# EAGLE design ecg (EAGLE 6.4)
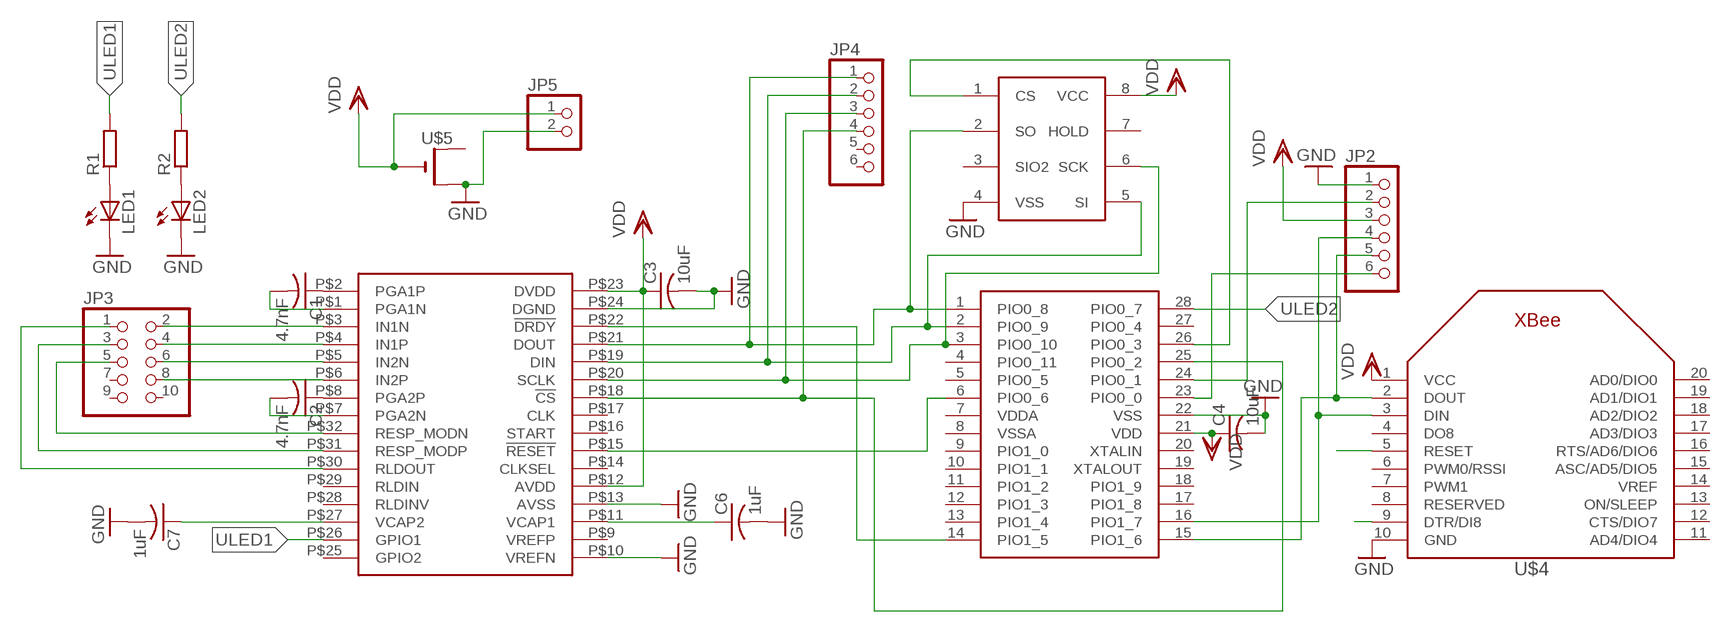
[diagram p0: schematic, sheet 1]

## Parts
C1  4.7nF  C-USC0805  [C0805]
C2  4.7nF  C-USC0805  [C0805]
C3  10uF  C-USC0805  [C0805]
C4  10uF  C-USC0805  [C0805]
C6  1uF  C-USC0805  [C0805]
C7  1uF  C-USC0805  [C0805]
JP2  PINHD-1X6  [1X06]
JP3  PINHD-2X5  [2X05]
JP4  PINHD-1X6  [1X06]
JP5  PINHD-1X2  [1X02]
LED1  LED3MM  [LED3MM]
LED2  LED3MM  [LED3MM]
R1  R-EU_R0805  [R0805]
R2  R-EU_R0805  [R0805]
U$1  ADS1929R  [TQFP32]
U$2  LPC1114FN28  [DIL28-6]
U$3  23A1024  [DIL08]
U$4  XBEE  [XBEE]
U$5  CR2032SMT  [CR2032-SMD]

## Nets
GND: C3.2 C4.2 C6.2 C7.2 JP2.1 JP5.2 LED1.K(C) LED2.K(C) U$1.P$10(VREFN) U$1.P$13(AVSS) U$1.P$24(DGND) U$2.22(VSS) U$3.4(VSS) U$4.10(GND) U$5.+$2(+1)
N$1: C1.1 U$1.P$2(PGA1P)
N$2: C1.2 U$1.P$1(PGA1N)
N$3: C2.1 U$1.P$8(PGA2P)
N$4: C2.2 U$1.P$7(PGA2N)
N$5: JP4.1 U$1.P$21(DOUT) U$2.1(PIO0_8) U$3.2(SO)
N$6: JP4.2 U$1.P$19(DIN) U$2.2(PIO0_9) U$3.5(SI)
N$7: JP4.3 U$1.P$20(SCLK) U$2.3(PIO0_10) U$3.6(SCK)
N$8: JP4.4 U$1.P$18(!CS!) U$2.25(PIO0_2)
N$9: U$1.P$22(!DRDY!) U$2.14(PIO1_5)
N$10: JP3.2 U$1.P$3(IN1N)
N$11: JP3.4 U$1.P$4(IN1P)
N$12: JP3.6 U$1.P$5(IN2N)
N$13: JP3.8 U$1.P$6(IN2P)
N$14: U$1.P$15(!RESET!) U$2.6(PIO0_6)
N$15: JP3.5 U$1.P$32(RESP_MODN)
N$16: JP3.3 U$1.P$31(RESP_MODP)
N$17: JP3.1 U$1.P$30(RLDOUT)
N$20: JP2.6 U$2.23(PIO0_0)
N$21: U$2.26(PIO0_3) U$3.1(CS)
N$22: JP2.5 U$2.15(PIO1_6) U$4.2(DOUT)
N$23: JP2.4 U$2.16(PIO1_7) U$4.3(DIN)
N$24: JP2.2 U$2.24(PIO0_1)
N$27: C6.1 U$1.P$11(VCAP1)
N$28: U$4.5(RESET)
N$29: LED1.A R1.1
N$30: LED2.A R2.1
N$31: U$4.9(DTR/DI8)
N$32: C7.1 U$1.P$27(VCAP2)
ULED1: R1.2 U$1.P$26(GPIO1)
ULED2: R2.2 U$2.28(PIO0_7)
VDD: C3.1 C4.1 JP2.3 JP5.1 U$1.P$12(AVDD) U$1.P$23(DVDD) U$2.21(VDD) U$3.8(VCC) U$4.1(VCC) U$5.-
Unconnected: JP3.7 JP3.9 JP3.10 JP4.5 JP4.6 U$1.P$9(VREFP) U$1.P$14(CLKSEL) U$1.P$16(START) U$1.P$17(CLK) U$1.P$25(GPIO2) U$1.P$28(RLDINV) U$1.P$29(RLDIN) U$2.4(PIO0_11) U$2.5(PIO0_5) U$2.7(VDDA) U$2.8(VSSA) U$2.9(PIO1_0) U$2.10(PIO1_1) U$2.11(PIO1_2) U$2.12(PIO1_3) U$2.13(PIO1_4) U$2.17(PIO1_8) U$2.18(PIO1_9) U$2.19(XTALOUT) U$2.20(XTALIN) U$2.27(PIO0_4) U$3.3(SIO2) U$3.7(HOLD) U$4.4(DO8) U$4.6(PWM0/RSSI) U$4.7(PWM1) U$4.8(RESERVED) U$4.11(AD4/DIO4) U$4.12(CTS/DIO7) U$4.13(ON/SLEEP) U$4.14(VREF) U$4.15(ASC/AD5/DIO5) U$4.16(RTS/AD6/DIO6) U$4.17(AD3/DIO3) U$4.18(AD2/DIO2) U$4.19(AD1/DIO1) U$4.20(AD0/DIO0) U$5.+$1(+)

## Library data of the parts
C1-C4 C6 C7 = adafruit:C-US: CAPACITOR, American symbol
JP2 JP4 = pinhead:PINHD-1X6: PIN HEADER
JP3 = pinhead:PINHD-2X5: PIN HEADER
JP5 = pinhead:PINHD-1X2: PIN HEADER
LED1 LED2 = adafruit:LED: LED OSRAM: - CHIPLED LG R971, LG N971, LY N971, LG Q971, LY Q971, LO R971, LY R971 LH N974, LH R974 LS Q976, LO Q976, LY Q976 LO Q996 - Hyper CHIPLED LW Q18S LB Q993, LB Q99A, LB R99A - SideLED LS A670, LO A670, LY A670, LG A670, LP A670 LB A673, LV A673, LT A673, LW A673 LH A674 LY A675 LS A676, LA A676, LO A676, LY A676, LW A676 LS A679, LY A679, LG A679 - Hyper Micro SIDELED® LS Y876, LA Y876, LO Y876, LY Y876 LT Y87S - SmartLED LW L88C, LW L88S LB L89C, LB L89S, LG L890 LS L89K, LO L89K, LY L89K LS L896, LA L896, LO L896, LY L896 - TOPLED LS T670, LO T670, LY T670, LG T670, LP T670 LSG T670, LSP T670, LSY T670, LOP T670, LYG T670 LG T671, LOG T671, LSG T671 LB T673, LV T673, LT T673, LW T673 LH T674 LS T676, LA T676, LO T676, LY T676, LB T676, LH T676, LSB T676, LW T676 LB T67C, LV T67C, LT T67C, LS T67K, LO T67K, LY T67K, LW E67C LS E67B, LA E67B, LO E67B, LY E67B, LB E67C, LV E67C, LT E67C LW T67C LS T679, LY T679, LG T679 LS T770, LO T770, LY T770, LG T770, LP T770 LB T773, LV T773, LT T773, LW T773 LH T774 LS E675, LA E675, LY E675, LS T675 LS T776, LA T776, LO T776, LY T776, LB T776 LHGB T686 LT T68C, LB T68C - Hyper Mini TOPLED® LB M676 - Mini TOPLED Santana® LG M470 LS M47K, LO M47K, LY M47K Source: http://www.osram.convergy.de/
R1 R2 = resistor:R-EU_: RESISTOR, European symbol
U$1 = ads1x9x:ADS1929R
U$2 = lpc1114fn28:LPC1114FN28
U$3 = 23a1024:23A1024
U$4 = adafruit:XBEE
U$5 = adafruit:CR2032

## Board
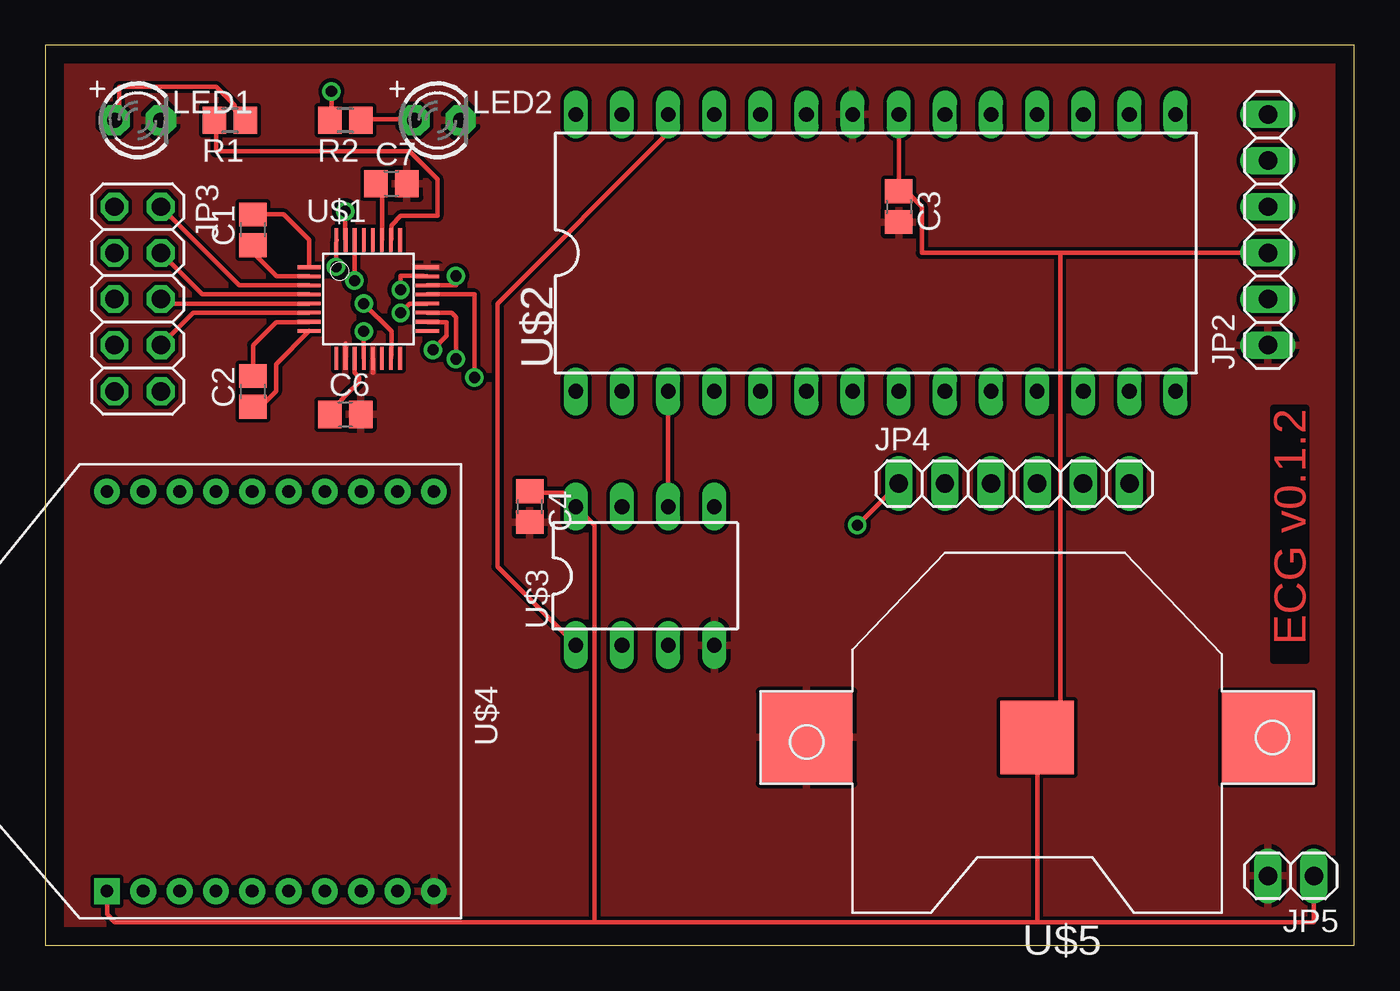
[diagram p1: board, top side]
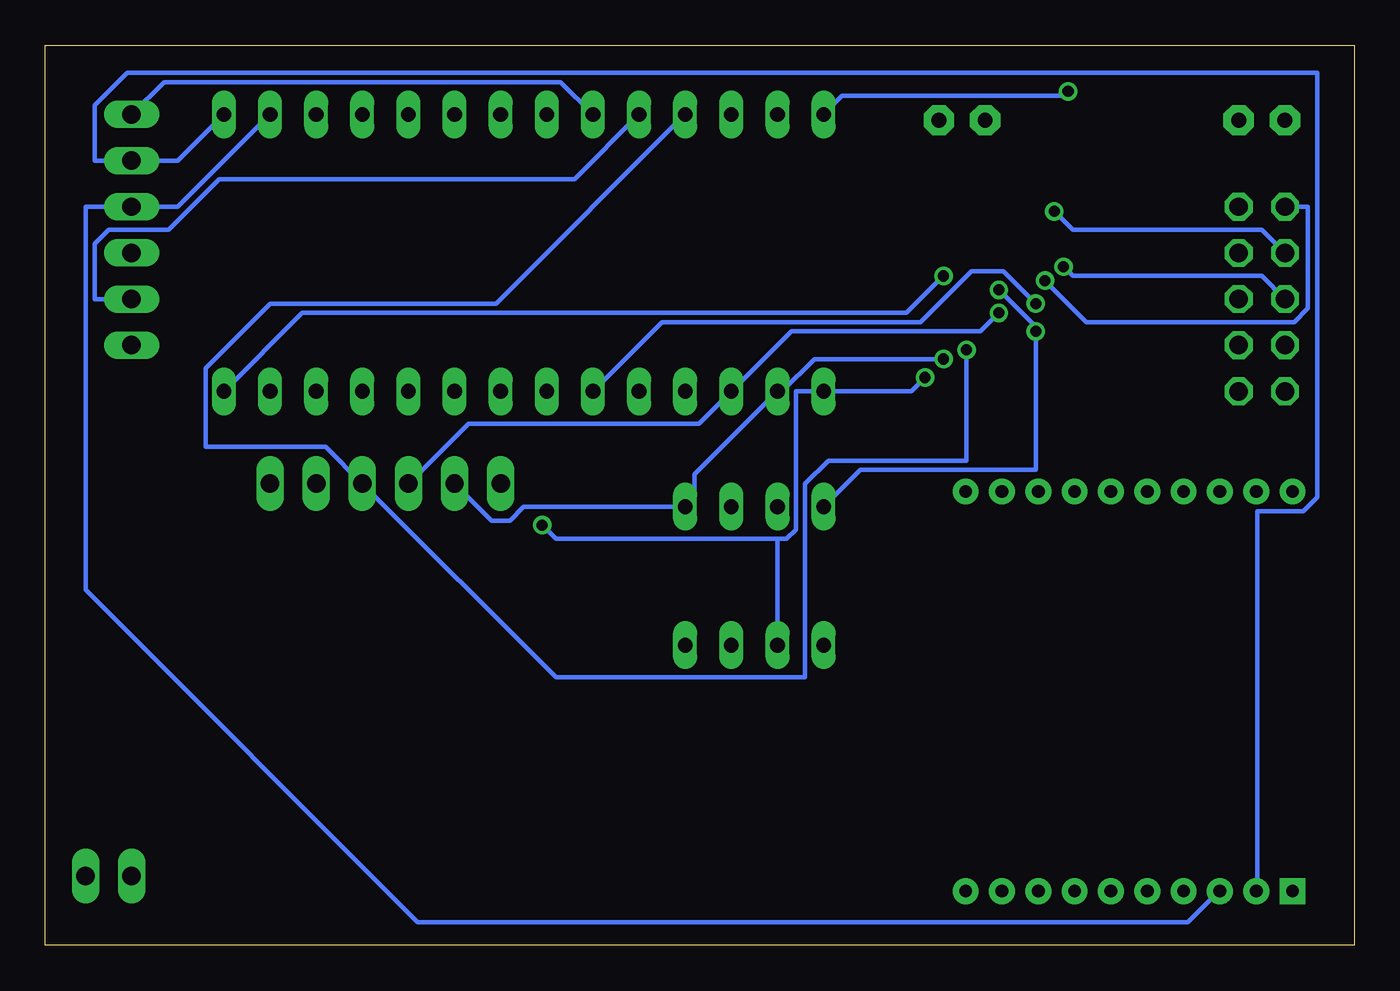
[diagram p2: board, bottom side, seen from below]

Size 72.06 x 49.52 mm. Coordinates in mm from the lower left corner, seen from the top.
Outline: 0,0 72.06,0 72.06,49.52 0,49.52 0,0
Copper layers (1*16): Top 0.035mm / dielectric 1.5mm / Bottom 0.035mm
Design rules "default": minimum track width 10mil, minimum drill 24mil, track to track 8mil, track to pad 8mil, pad to pad 8mil, via to via 8mil, smd to smd 8mil, copper to edge 40mil, drill to drill 8mil, minimum pad ring 10mil, minimum via ring 8mil, stop-mask expansion 4mil, vias tented up to drill 0mil, thermal gap 10mil

### Footprints (pad centres in the part's own frame; a part is rotated, then mirrored left to right if it is on the bottom)
C0805 = smd 1.3 x 1.5: 1 -0.85,0; 2 0.85,0
1X06 = drill 1.016 long: 1 -6.35,0; 2 -3.81,0; 3 -1.27,0; 4 1.27,0; 5 3.81,0; 6 6.35,0
2X05 = drill 1.016 octagon: 1 -5.08,-1.27; 2 -5.08,1.27; 3 -2.54,-1.27; 4 -2.54,1.27; 5 0,-1.27; 6 0,1.27; 7 2.54,-1.27; 8 2.54,1.27; 9 5.08,-1.27; 10 5.08,1.27
1X02 = drill 1.016 long: 1 -1.27,0; 2 1.27,0
LED3MM = drill 0.813 pad 1.676 octagon: A -1.27,0; K 1.27,0
R0805 = smd 1.3 x 1.5: 1 -0.85,0; 2 0.85,0
TQFP32 = smd 1.27 x 0.2: P$1 -3.25,1.75; P$2 -3.25,1.25; P$3 -3.25,0.75; P$4 -3.25,0.25; P$5 -3.25,-0.25; P$6 -3.25,-0.75; P$7 -3.25,-1.25; P$8 -3.25,-1.75; P$17 3.25,-1.75; P$18 3.25,-1.25; P$19 3.25,-0.75; P$20 3.25,-0.25; P$21 3.25,0.25; P$22 3.25,0.75; P$23 3.25,1.25; P$24 3.25,1.75 | smd 0.2 x 1.27: P$9 -1.75,-3.25; P$10 -1.25,-3.25; P$11 -0.75,-3.25; P$12 -0.25,-3.25; P$13 0.25,-3.25; P$14 0.75,-3.25; P$15 1.25,-3.25; P$16 1.75,-3.25; P$25 1.75,3.25; P$26 1.25,3.25; P$27 0.75,3.25; P$28 0.25,3.25; P$29 -0.25,3.25; P$30 -0.75,3.25; P$31 -1.25,3.25; P$32 -1.75,3.25
DIL28-6 = drill 0.813 long: 1 -16.51,-7.62; 2 -13.97,-7.62; 3 -11.43,-7.62; 4 -8.89,-7.62; 5 -6.35,-7.62; 6 -3.81,-7.62; 7 -1.27,-7.62; 8 1.27,-7.62; 9 3.81,-7.62; 10 6.35,-7.62; 11 8.89,-7.62; 12 11.43,-7.62; 13 13.97,-7.62; 14 16.51,-7.62; 15 16.51,7.62; 16 13.97,7.62; 17 11.43,7.62; 18 8.89,7.62; 19 6.35,7.62; 20 3.81,7.62; 21 1.27,7.62; 22 -1.27,7.62; 23 -3.81,7.62; 24 -6.35,7.62; 25 -8.89,7.62; 26 -11.43,7.62; 27 -13.97,7.62; 28 -16.51,7.62
DIL08 = drill 0.813 long: 1 -3.81,-3.81; 2 -1.27,-3.81; 3 1.27,-3.81; 4 3.81,-3.81; 5 3.81,3.81; 6 1.27,3.81; 7 -1.27,3.81; 8 -3.81,3.81
XBEE = drill 0.7 pad 1.422 square: 1 -11,5.5 | drill 0.7 pad 1.422: 2 -11,3.5; 3 -11,1.5; 4 -11,-0.5; 5 -11,-2.5; 6 -11,-4.5; 7 -11,-6.5; 8 -11,-8.5; 9 -11,-10.5; 10 -11,-12.5; 11 11,-12.5; 12 11,-10.5; 13 11,-8.5; 14 11,-6.5; 15 11,-4.5; 16 11,-2.5; 17 11,-0.5; 18 11,1.5; 19 11,3.5; 20 11,5.5
CR2032-SMD = smd 5.08 x 5.08: +$1 -12.7,0; +$2 12.7,0 | smd 4.064 x 4.064: - 0,0

### Placement (x,y rotation side)
C1  11.43,39.37 90 top
C2  11.43,30.48 90 top
C3  46.99,40.64 270 top
C4  26.67,24.13 270 top
C6  16.51,29.21 0 top
C7  19.05,41.91 0 top
JP2  67.31,39.37 90 top
JP3  5.08,35.56 270 top
JP4  53.34,25.4 0 top
JP5  68.58,3.81 180 top
LED1  5.08,45.4 0 top
LED2  21.59,45.4 0 top
R1  10.16,45.4 180 top
R2  16.51,45.4 180 top
U$1  17.78,35.56 0 top
U$2  45.72,38.1 0 top
U$3  33.02,20.32 0 top
U$4  8.89,13.97 90 top
U$5  54.61,11.43 180 top

### Tracks (layer width: path | path; a pad name or v marks a point on that pad's centre or on a via)
GND
  Top 0.254: 16.51,33.02 16.51,32.51 U$1.P$10 | 16.51,33.02 16.53,33.12 16.51,33.02 | U$1.P$13 18.03,32.26 18.03,31.5
  pour Top: -1.27,50.8 71.12,50.8 71.12,-1.27 -1.27,-1.27
N$1
  Top 0.254: U$1.P$2 12.72,36.81 11.43,38.1 C1.1
N$2
  Top 0.254: U$1.P$1 14.53,38.81 13.12,40.22 C1.2
N$3
  Top 0.254: U$1.P$8 12.7,31.98 12.7,30.48 11.85,29.63 C2.1
N$4
  Top 0.254: U$1.P$7 14.51,34.29 12.7,34.29 11.43,33.02 C2.2
N$5  (via drill 0.61)
  Top 0.254: v23.62,31.24 23.62,35.81 21.08,35.81 U$1.P$21 | v44.7,23.11 JP4.1
  Bottom 0.254: v23.62,31.24 24.38,30.48 U$2.1 30.73,30.48 30.73,22.86 31.24,22.35 31.75,22.35 | 31.75,22.35 U$3.2 | v44.7,23.11 43.94,22.35 31.75,22.35
N$6  (via drill 0.61)
  Top 0.254: v22.61,32.26 22.61,34.54 22.35,34.8 21.08,34.8 U$1.P$19
  Bottom 0.254: v22.61,32.26 29.72,32.26 31.5,30.48 U$2.2 36.32,25.91 36.32,24.13 U$3.5 45.72,24.13 46.48,23.37 47.5,23.37 49.28,25.15 49.28,25.4 JP4.2
N$7  (via drill 0.61)
  Top 0.254: v19.56,34.8 20.07,35.31 20.83,35.31 U$1.P$20 | U$2.3 U$3.6
  Bottom 0.254: v19.56,34.8 20.57,33.78 30.99,33.78 U$2.3 36.07,28.7 48.77,28.7 JP4.3
N$8  (via drill 0.61)
  Top 0.254: v21.34,32.77 22.1,33.53 22.1,34.29 21.08,34.29 U$1.P$18
  Bottom 0.254: v21.34,32.77 21.34,26.67 28.96,26.67 30.23,25.4 30.23,14.73 43.94,14.73 JP4.4 56.64,27.43 63.25,27.43 63.25,31.75 59.69,35.31 47.24,35.31 U$2.25
N$9  (via drill 0.61)
  Top 0.254: v22.61,36.83 22.61,36.32 21.08,36.32 U$1.P$22
  Bottom 0.254: v22.61,36.83 24.64,34.8 57.91,34.8 U$2.14
N$10
  Top 0.254: U$1.P$3 10.68,36.31 JP3.2
N$11
  Top 0.254: U$1.P$4 8.64,35.81 JP3.4
N$12
  Top 0.254: U$1.P$5 6.35,35.31 JP3.6
N$13
  Top 0.254: U$1.P$6 8.14,34.81 JP3.8
N$14  (via drill 0.61)
  Top 0.254: v17.53,35.31 19.05,33.78 19.05,32.51 U$1.P$15
  Bottom 0.254: v17.53,35.31 19.3,37.08 21.08,37.08 23.88,34.29 38.1,34.29 U$2.6
N$15  (via drill 0.61)
  Top 0.254: v16,37.34 16,38.61 U$1.P$32
  Bottom 0.254: v16,37.34 15.49,36.83 5.08,36.83 JP3.5
N$16  (via drill 0.61)
  Top 0.254: v16.51,40.39 16.51,38.86 U$1.P$31
  Bottom 0.254: v16.51,40.39 15.49,39.37 5.08,39.37 JP3.3
N$17  (via drill 0.61)
  Top 0.254: v17.02,36.58 17.02,38.61 U$1.P$30
  Bottom 0.254: v17.02,36.58 14.73,34.29 3.3,34.29 2.54,35.05 2.54,40.64 JP3.1
N$20
  Bottom 0.254: U$2.23 43.69,47.5 65.53,47.5 JP2.6
N$21
  Top 0.254: U$3.1 24.89,20.83 24.89,35.31 34.29,44.7 U$2.26
N$22
  Bottom 0.254: U$2.15 64.77,43.18 JP2.5 69.34,43.18 69.34,46.23 67.56,48.01 2.03,48.01 2.03,24.64 2.79,23.88 5.33,23.88 5.33,3.05 U$4.2
N$23
  Bottom 0.254: U$2.16 64.77,40.64 JP2.4 69.85,40.64 69.85,19.56 51.56,1.27 9.14,1.27 7.62,2.79 U$4.3
N$24
  Bottom 0.254: U$2.24 42.93,42.16 62.48,42.16 65.28,39.37 68.58,39.37 69.34,38.61 69.34,35.56 JP2.2
N$27
  Top 0.254: U$1.P$11 17.02,32.26 17.02,31.5 17.27,31.24 17.27,30.99 16.51,30.23 C6.1
N$29
  Top 0.254: R1.1 10.92,45.47 10.41,45.97 10.41,46.23 9.4,47.24 4.06,47.24 4.06,45.72 3.81,45.47 LED1.A
N$30
  Top 0.254: R2.1 17.53,45.47 20.32,45.47 LED2.A
N$32
  Top 0.254: U$1.P$27 18.53,41.58 C7.1
ULED1
  Top 0.254: U$1.P$26 19.05,38.86 19.05,39.62 19.56,40.13 21.59,40.13 21.59,42.16 20.07,43.69 9.4,43.69 9.4,45.21 R1.2
ULED2  (via drill 0.61)
  Top 0.254: v15.75,46.99 15.75,45.47 R2.2
  Bottom 0.254: v15.75,46.99 16,46.74 28.19,46.74 U$2.28
VDD  (via drill 0.61)
  Top 0.254: U$4.1 3.39,1.69 3.81,1.27 30.23,1.27 | 30.23,1.27 54.61,1.27 | 54.61,1.27 69.85,1.27 JP5.1 | U$2.21 46.99,41.91 | 46.99,41.91 C3.1 46.99,41.66 | 55.88,38.1 48.26,38.1 48.26,40.64 46.99,41.91 | 55.88,38.1 JP2.3 | 54.61,1.27 U$5.- 55.88,12.7 55.88,38.1 | v17.53,33.78 17.53,32.51 U$1.P$12 | v19.56,36.07 19.56,36.83 20.83,36.83 U$1.P$23 | C4.1 26.67,24.89 29.21,24.89 U$3.8 30.23,23.11 30.23,1.27
  Bottom 0.254: U$3.8 27.18,26.16 17.53,26.16 v17.53,33.78 17.53,34.04 v19.56,36.07

### Text on the board
Top: ECG v0.1.2